# EAGLE design 2019-03-06-can-display-v8.1 (EAGLE 9.4.1)

## Sheet 1 of 2
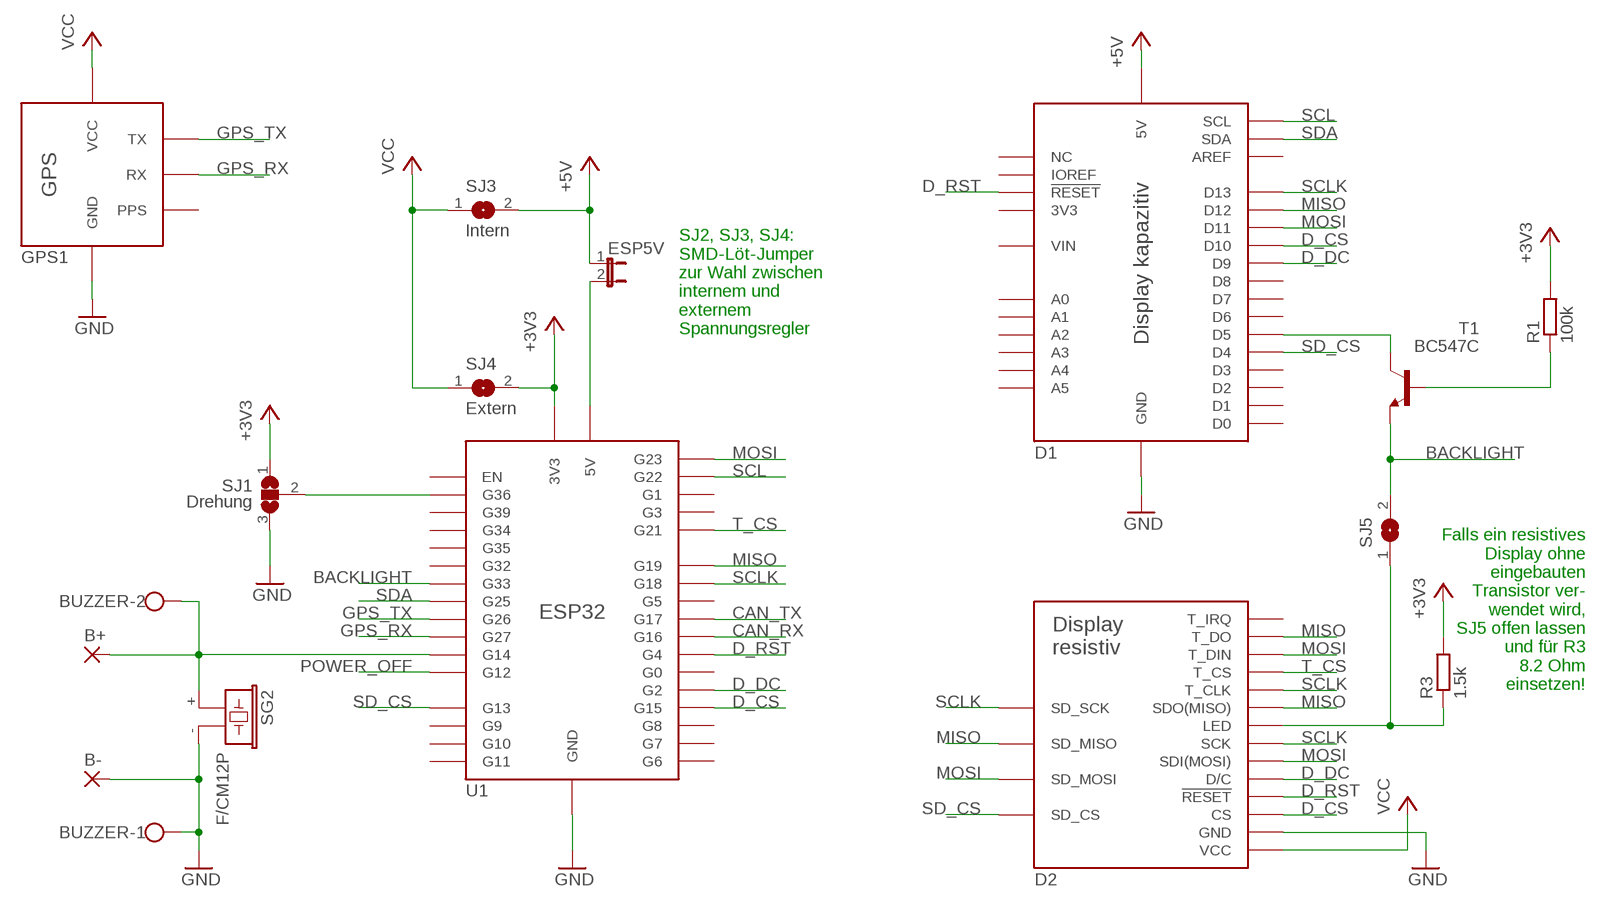
[diagram p0: schematic, sheet 1]

### Parts
B+  WIREPADSMD5-2,5  [5-2,5]
B-  WIREPADSMD5-2,5  [5-2,5]
BUZZER  W237-102  [W237-102]
D1  TFT-KAPAZITIV  [TFT-KAPAZITIV]
D2  TFT-RESISTIV  [TFT-RESISTIV]
ESP5V  ESP 5V  JP1E  [JP1]
GPS1  GPS  [GPS]
R1  100k  R-EU_VMTA55  [VMTA55]
R3  1.5k  R-EU_VMTA55  [VMTA55]
SG2  F/CM12P  [F/CM12P]
SJ1  Drehung  SJ2W  [SJ_2]
SJ3  Intern  SJ  [SJ]
SJ4  Extern  SJ  [SJ]
SJ5  const.  SJ  [SJ]
T1  BC547C  -NPN-TO92  [TO92]
U1  ESP32  [ESP32]

### Nets
+3V3: R1.2 R3.2 SJ1.1 SJ4.2 U1.3V3 U1.3V3S(3V3) ; also sheet 2
+5V: D1.5V ESP5V.1 SJ3.2 ; also sheet 2
BACKLIGHT: SJ5.2 T1.1(E) U1.G33 U1.G33S(G33)
BUZZER: B+.1(P) BUZZER.2 SG2.+ U1.G14 U1.G14S(G14)
CAN_RX: U1.G16 ; also sheet 2
CAN_TX: U1.G17 ; also sheet 2
D_CS: D1.D10 D2.LCD_CS(CS) U1.G15
D_DC: D1.D9 D2.LCD_DC(D/C) U1.G2
D_RST: D1.RESET(!RESET!) D2.LCD_RESET(!RESET!) U1.G4
DIS-BL: D2.LED R3.1 SJ5.1
ESP5V: ESP5V.2 U1.5V U1.5VS(5V)
GND: B-.1(P) BUZZER.1 D1.GND@1(GND) D1.GND@2(GND) D1.GND@3(GND) D2.GND GPS1.GND1(GND) GPS1.GND2(GND) SG2.- SJ1.3 U1.GND@1(GND) U1.GND@2(GND) U1.GND@3(GND) U1.GND@4(GND) ; also sheet 2
GPS_RX: GPS1.RX1(RX) GPS1.RX2(RX) U1.G27 U1.G27S(G27)
GPS_TX: GPS1.TX1(TX) GPS1.TX2(TX) U1.G26 U1.G26S(G26)
MISO: D1.D12 D2.LCD_MISO(SDO(MISO)) D2.SD_MISO D2.T_DO U1.G19
MOSI: D1.D11 D2.LCD_MOSI(SDI(MOSI)) D2.SD_MOSI D2.T_DIN U1.G23
N$1: SJ1.2 U1.G36 U1.G36S(G36)
N$2: D1.D5 T1.3(C)
N$4: R1.1 T1.2(B)
POWER_OFF: U1.G12 U1.G12S(G12) ; also sheet 2
SCL: D1.KAP_SCL(SCL) U1.G22
SCLK: D1.D13 D2.LCD_SCK(SCK) D2.SD_SCK D2.T_CLK U1.G18
SD_CS: D1.D4 D2.SD_CS U1.G13 U1.G13S(G13)
SDA: D1.KAP_SDA(SDA) U1.G25 U1.G25S(G25)
T_CS: D2.T_CS U1.G21
VCC: D2.VCC GPS1.VCC1(VCC) GPS1.VCC2(VCC) SJ3.1 SJ4.1 ; also sheet 2
Unconnected: D1.3V3 D1.A0 D1.A1 D1.A2 D1.A3 D1.A4 D1.A5 D1.AREF D1.D0 D1.D1 D1.D2 D1.D3 D1.D6 D1.D7 D1.D8 D1.IOREF D1.NC@1(NC) D1.VIN D2.T_IRQ GPS1.PPS2(PPS) U1.EN U1.ENS(EN) U1.G0 U1.G1 U1.G3 U1.G5 U1.G6 U1.G7 U1.G8 U1.G9 U1.G9S(G9) U1.G10 U1.G10S(G10) U1.G11 U1.G11S(G11) U1.G32 U1.G32S(G32) U1.G34 U1.G34S(G34) U1.G35 U1.G35S(G35) U1.G39 U1.G39S(G39)

### Notes on the sheet
- SJ2, SJ3, SJ4:
  SMD-Löt-Jumper
  zur Wahl zwischen
  internem und
  externem
  Spannungsregler
- Falls ein resistives
  Display ohne
  eingebauten
  Transistor ver-
  wendet wird,
  SJ5 offen lassen
  und für R3
  8.2 Ohm
  einsetzen!

## Sheet 2 of 2
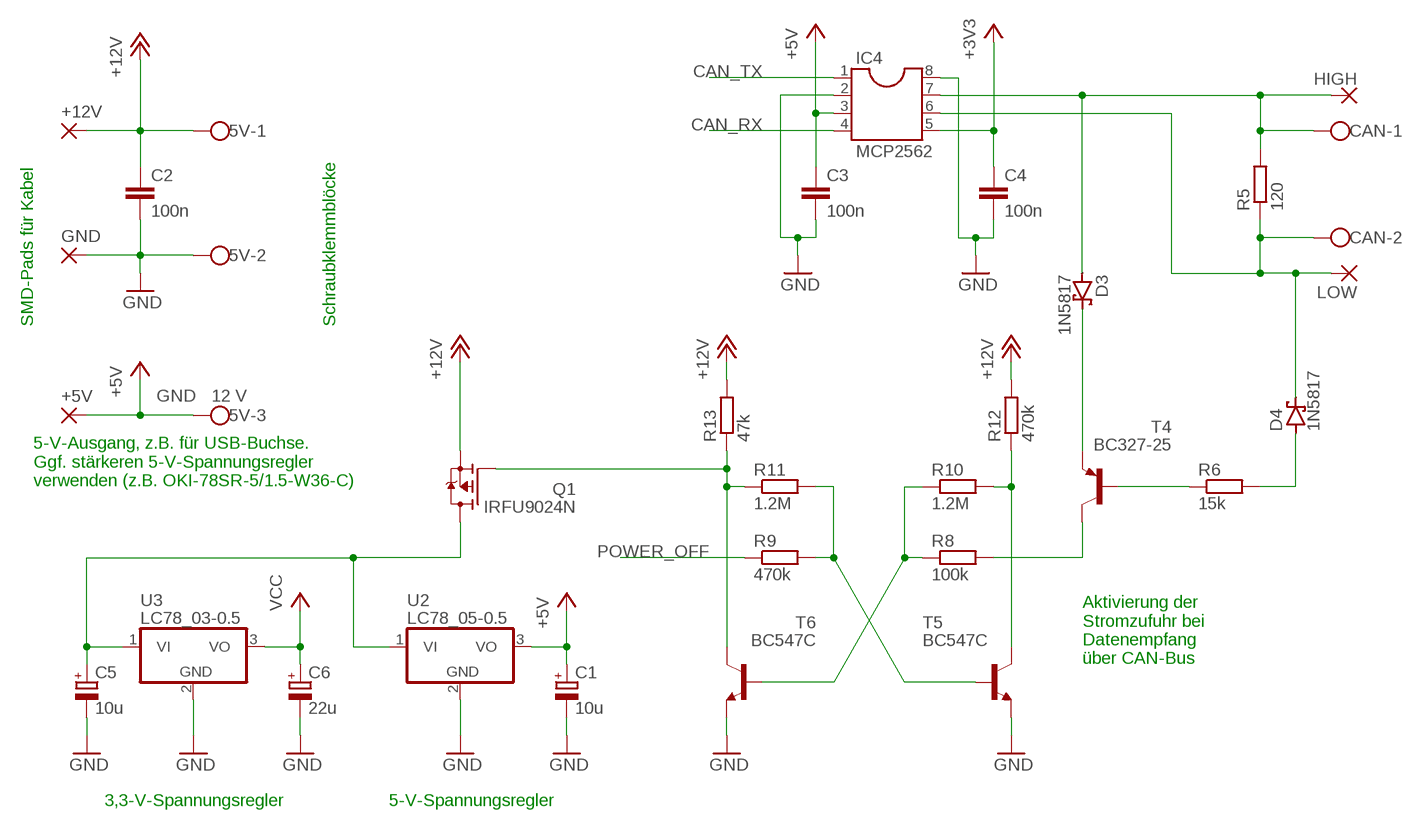
[diagram p1: schematic, sheet 2]

### Parts
5V  GND 12 V  W237-103  [W237-103]
+5V  WIREPADSMD5-2,5  [5-2,5]
+12V  WIREPADSMD5-2,5  [5-2,5]
C1  10u  CPOL-EUE1.8-4  [E1,8-4]
C2  100n  C-EU025-025X050  [C025-025X050]
C3  100n  C-EU025-025X050  [C025-025X050]
C4  100n  C-EU025-025X050  [C025-025X050]
C5  10u  CPOL-EUE1.8-4  [E1,8-4]
C6  22u  CPOL-EUE1.8-4  [E1,8-4]
CAN  W237-102  [W237-102]
D3  1N5817  1N5817-T  [DO41-7.6]
D4  1N5817  1N5817-T  [DO41-7.6]
GND  WIREPADSMD5-2,5  [5-2,5]
HIGH  WIREPADSMD5-2,5  [5-2,5]
IC4  MCP2562  DIL8  [DIL08]
LOW  WIREPADSMD5-2,5  [5-2,5]
Q1  IRFU9024N  P-CHANNEL-MOSFET  [TO251AA-V]
R5  120  R-EU_VMTA55  [VMTA55]
R6  15k  R-EU_VMTA55  [VMTA55]
R8  100k  R-EU_VMTA55  [VMTA55]
R9  470k  R-EU_VMTA55  [VMTA55]
R10  1.2M  R-EU_VMTA55  [VMTA55]
R11  1.2M  R-EU_VMTA55  [VMTA55]
R12  470k  R-EU_VMTA55  [VMTA55]
R13  47k  R-EU_VMTA55  [VMTA55]
T4  BC327-25  -PNP-TO92  [TO92]
T5  BC547C  -NPN-TO92  [TO92]
T6  BC547C  -NPN-TO92  [TO92]
U2  LC78_05-0.5  SPANNUNGSREGLER  [SPANNUNGSREGLER]
U3  LC78_03-0.5  SPANNUNGSREGLER  [SPANNUNGSREGLER]

### Nets
+3V3: C4.1 IC4.5 ; also sheet 1
+5V: 5V.3 +5V.1(P) C1.+ C3.1 IC4.3 U2.3(VO) ; also sheet 1
+12V: 5V.1 +12V.1(P) C2.1 Q1.3(S) R12.2 R13.2
CAN_RX: IC4.4 ; also sheet 1
CAN_TX: IC4.1 ; also sheet 1
GND: 5V.2 C1.- C2.2 C3.2 C4.2 C5.- C6.- GND.1(P) IC4.2 IC4.8 T5.1(E) T6.1(E) U2.2(GND) U3.2(GND) ; also sheet 1
N$8: D3.C T4.1(E)
N$9: R6.1 T4.2(B)
N$10: D4.A R6.2
N$11: R8.1 R10.1 T6.2(B)
N$13: CAN.1 D3.A HIGH.1(P) IC4.7 R5.2
N$14: CAN.2 D4.C IC4.6 LOW.1(P) R5.1
N$15: R8.2 T4.3(C)
N$16: R9.2 R11.2 T5.2(B)
N$17: R10.2 R12.1 T5.3(C)
N$18: Q1.1(G) R11.1 R13.1 T6.3(C)
N$20: C5.+ Q1.2(D) U2.1(VI) U3.1(VI)
POWER_OFF: R9.1 ; also sheet 1
VCC: C6.+ U3.3(VO) ; also sheet 1

### Notes on the sheet
- SMD-Pads für Kabel | Schraubklemmblöcke
- 5-V-Ausgang, z.B. für USB-Buchse.
  Ggf. stärkeren 5-V-Spannungsregler
  verwenden (z.B. OKI-78SR-5/1.5-W36-C)
- Aktivierung der
  Stromzufuhr bei
  Datenempfang
  über CAN-Bus
- 3,3-V-Spannungsregler | 5-V-Spannungsregler

## Library data of the parts
5V = con-wago-500:W237-103: WAGO SCREW CLAMP; MPN: 237-103; OC_FARNELL: unknown; OC_NEWARK: 18M7116
+5V +12V B+ B- GND HIGH LOW = wirepad:WIREPAD: Wire PAD connect wire on PCB
BUZZER CAN = con-wago-500:W237-102: WAGO SCREW CLAMP; MPN: 237-102; OC_FARNELL: unknown; OC_NEWARK: 70K9898
C1 C5 C6 = rcl:CPOL-EU: POLARIZED CAPACITOR, European symbol; SPICEPREFIX: C
C2-C4 = rcl:C-EU: CAPACITOR, European symbol; SPICEPREFIX: C
D1 = CAN-Display:TFT-KAPAZITIV: TFT-Kapazitiv
D2 = CAN-Display:TFT-RESISTIV: TFT-Resistiv
D3 D4 = diode:1N581*: 1.0A SCHOTTKY BARRIER RECTIFIER Source: http://www.diodes.com/datasheets/ds23001.pdf
ESP5V = jumper:JP1E: JUMPER
GPS1 = CAN-Display:GPS: GPS
IC4 = ic-package:DIL8: Dual In Line / Socket
Q1 = CAN-Display:P-CHANNEL-MOSFET
R1 R3 R5 R6 R8-R13 = rcl:R-EU_: RESISTOR, European symbol; SPICEPREFIX: R
SG2 = buzzer:F/CM12P: BUZZER Source: Buerklin; OC_FARNELL: unknown; OC_NEWARK: unknown
SJ1 = jumper:SJ2W: SMD solder JUMPER
SJ3-SJ5 = jumper:SJ: SMD solder JUMPER
T1 T5 T6 = transistor:*-NPN-: NPN Transistror BF959 corrected 2008.03.06
T4 = transistor:*-PNP-: PNP Transistror
U1 = CAN-Display:ESP32: ESP32 Development Board
U2 U3 = CAN-Display:SPANNUNGSREGLER

## Board
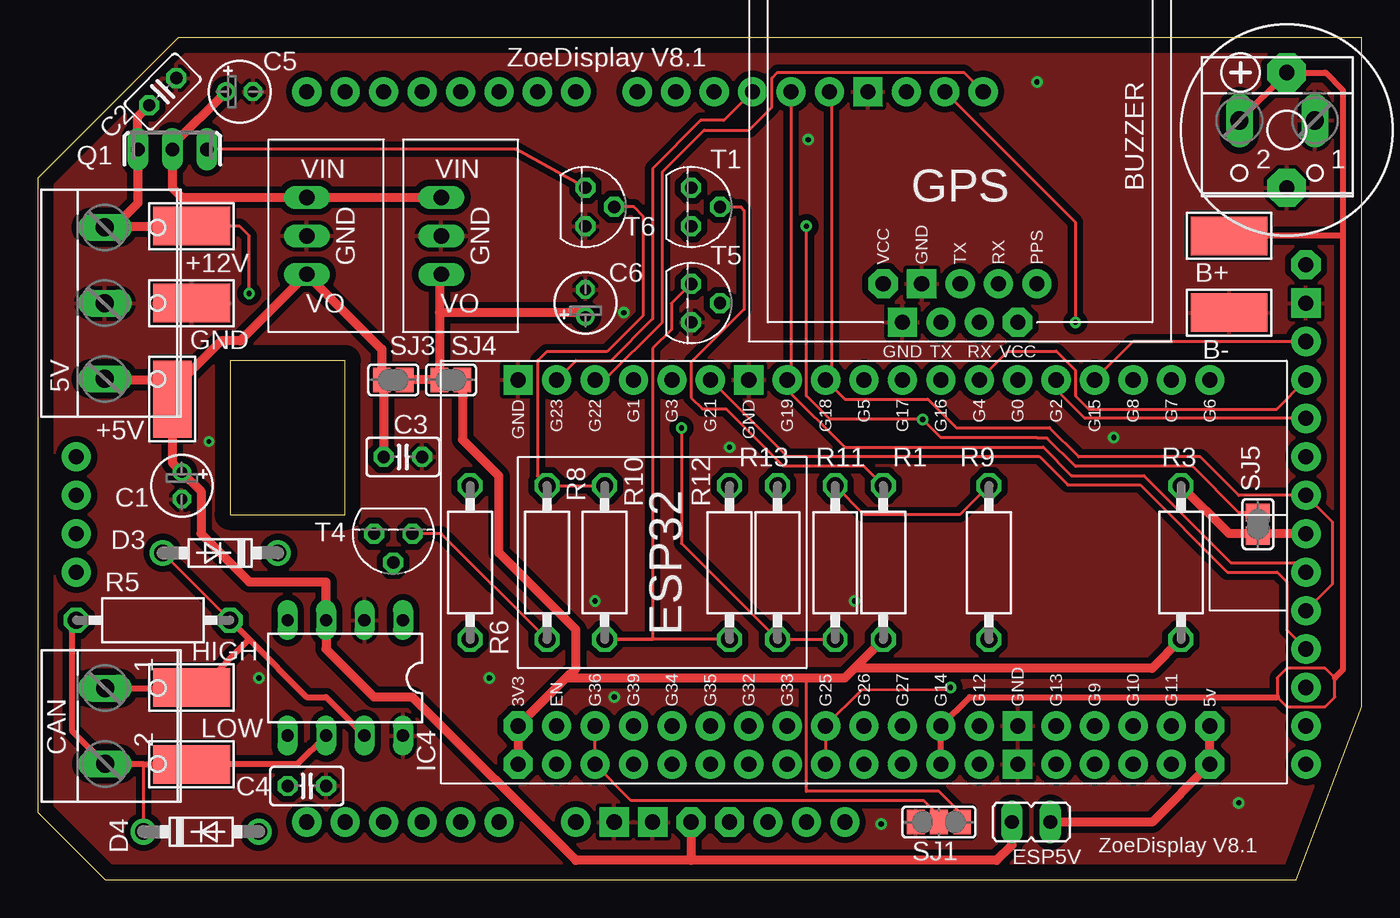
[diagram p2: board, top side]
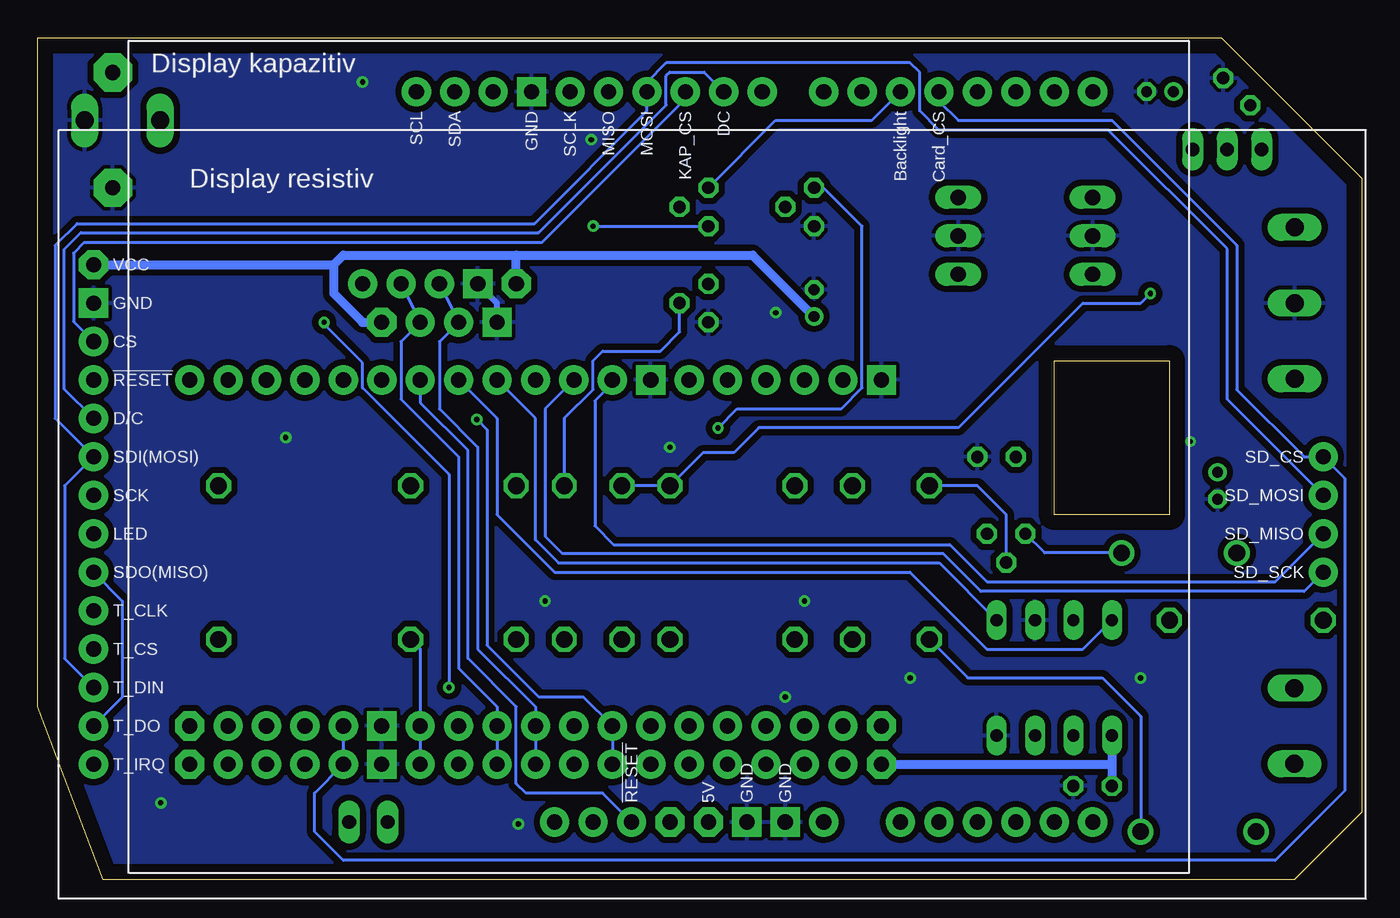
[diagram p3: board, bottom side, seen from below]

Size 87.5 x 55.63 mm. Coordinates in mm from the lower left corner, seen from the top.
Outline: 0,46.35 0,4.45 4.45,0 83.19,0 87.5,11.43 87.5,55.63 9.27,55.63 0,46.35
Outline: 20.32,34.29 12.7,34.29 12.7,24.13 20.32,24.13 20.32,34.29
Copper layers (1*16): Top 0.035mm / dielectric 1.5mm / Bottom 0.035mm
Design rules "default *": minimum track width 6mil, minimum drill 0.35mm, track to track 16mil, track to pad 8mil, pad to pad 10mil, via to via 20mil, smd to smd 6mil, copper to edge 40mil, drill to drill 6mil, minimum pad ring 10mil, minimum via ring 8mil, stop-mask expansion 4mil, vias tented up to drill 0mil, thermal gap 10mil

### Footprints (pad centres in the part's own frame; a part is rotated, then mirrored left to right if it is on the bottom)
W237-103 = drill 1.194 long: 1 -5,-1.29; 2 0,-1.29; 3 5,-1.29
5-2,5 = smd 2.54 x 5.08: 1 0,0
W237-102 = drill 1.194 long: 1 -2.5,-1.27; 2 2.5,-1.27
E1,8-4 = drill 0.711 pad 1.168: + -0.889,0 | drill 0.711 pad 1.168 octagon: - 0.889,0
C025-025X050 = drill 0.813 octagon: 1 -1.27,0; 2 1.27,0
TFT-KAPAZITIV = drill 1 pad 1.93 octagon: 3V3 1.27,-24.13; 5V 3.81,-24.13 | drill 1 pad 1.93: A0 16.51,-24.13; A1 19.05,-24.13; A2 21.59,-24.13; A3 24.13,-24.13; A4 26.67,-24.13; A5 29.21,-24.13; AREF -10.414,24.13; D0 29.21,24.13; D1 26.67,24.13; D2 24.13,24.13; D3 21.59,24.13; D4 19.05,24.13; D5 16.51,24.13; D6 13.97,24.13; D7 11.43,24.13; D8 7.366,24.13; D9 4.826,24.13; D10 2.286,24.13; D11 -0.254,24.13; D12 -2.794,24.13; D13 -5.334,24.13; IOREF -3.81,-24.13; KAP_SCL -15.494,24.13; KAP_SDA -12.954,24.13; NC@1 -6.35,-24.13; RESET -1.27,-24.13; VIN 11.43,-24.13 | drill 1 pad 1.93 square: GND@1 6.35,-24.13; GND@2 8.89,-24.13; GND@3 -7.874,24.13
TFT-RESISTIV = drill 1 pad 1.93 square: GND 0,-13.97 | drill 1 pad 1.93: LCD_CS 0,-11.43; LCD_DC 0,-6.35; LCD_MISO 0,3.81; LCD_MOSI 0,-3.81; LCD_RESET 0,-8.89; LCD_SCK 0,-1.27; LED 0,1.27; SD_CS -81.28,-3.81; SD_MISO -81.28,1.27; SD_MOSI -81.28,-1.27; SD_SCK -81.28,3.81; T_CLK 0,6.35; T_CS 0,8.89; T_DIN 0,11.43; T_DO 0,13.97; T_IRQ 0,16.51 | drill 1 pad 1.93 octagon: VCC 0,-16.51
DO41-7.6 = drill 1.1 pad 1.7: A 3.81,0; C -3.81,0
JP1 = drill 0.914 long: 1 0,-1.27; 2 0,1.27
GPS = drill 1 pad 1.93 square: GND1 3.81,0; GND2 2.54,-2.54 | drill 1 pad 1.93: PPS2 -5.08,-2.54; RX1 -1.27,0; RX2 -2.54,-2.54; TX1 1.27,0; TX2 0,-2.54 | drill 1 pad 1.93 octagon: VCC1 -3.81,0; VCC2 5.08,-2.54
DIL08 = drill 0.813 long: 1 -3.81,-3.81; 2 -1.27,-3.81; 3 1.27,-3.81; 4 3.81,-3.81; 5 3.81,3.81; 6 1.27,3.81; 7 -1.27,3.81; 8 -3.81,3.81
TO251AA-V = drill 0.889 long: 1 -2.286,0; 2 0,0; 3 2.286,0
VMTA55 = drill 1.1 octagon: 1 -5.08,0; 2 5.08,0
F/CM12P = drill 1.016 pad 2.54 octagon: + 3.81,0; - -3.81,0
SJ_2 = smd 1.168 x 1.6: 1 -1.524,0; 2 0,0; 3 1.524,0
SJ = smd 1.168 x 1.6: 1 -0.762,0; 2 0.762,0
TO92 = drill 0.813 octagon: 1 1.27,0; 2 0,1.905; 3 -1.27,0
ESP32 = drill 1 pad 1.93 octagon: 3V3 -12.7,20.32; 3V3S -10.16,20.32; 5V -12.7,-25.4; 5VS -10.16,-25.4 | drill 1 pad 1.93: EN -12.7,17.78; ENS -10.16,17.78; G0 12.7,-12.7; G1 12.7,12.7; G2 12.7,-15.24; G3 12.7,10.16; G4 12.7,-10.16; G5 12.7,-2.54; G6 12.7,-25.4; G7 12.7,-22.86; G8 12.7,-20.32; G9 -12.7,-17.78; G9S -10.16,-17.78; G10 -12.7,-20.32; G10S -10.16,-20.32; G11 -12.7,-22.86; G11S -10.16,-22.86; G12 -12.7,-10.16; G12S -10.16,-10.16; G13 -12.7,-15.24; G13S -10.16,-15.24; G14 -12.7,-7.62; G14S -10.16,-7.62; G15 12.7,-17.78; G16 12.7,-7.62; G17 12.7,-5.08; G18 12.7,0; G19 12.7,2.54; G21 12.7,7.62; G22 12.7,15.24; G23 12.7,17.78; G25 -12.7,0; G25S -10.16,0; G26 -12.7,-2.54; G26S -10.16,-2.54; G27 -12.7,-5.08; G27S -10.16,-5.08; G32 -12.7,5.08; G32S -10.16,5.08; G33 -12.7,2.54; G33S -10.16,2.54; G34 -12.7,10.16; G34S -10.16,10.16; G35 -12.7,7.62; G35S -10.16,7.62; G36 -12.7,15.24; G36S -10.16,15.24; G39 -12.7,12.7; G39S -10.16,12.7 | drill 1 pad 1.93 square: GND@1 -12.7,-12.7; GND@2 12.7,5.08; GND@3 12.7,20.32; GND@4 -10.16,-12.7
SPANNUNGSREGLER = drill 1.016 long: 1 -2.54,-2.54; 2 0,-2.54; 3 2.54,-2.54

### Placement (x,y rotation side)
5V  5.71,38.1 270 top
+5V  8.89,31.75 0 top
+12V  10.16,43.18 270 top
B+  78.74,42.55 90 top
B-  78.74,37.47 90 top
BUZZER  81.92,48.9 180 top
C1  9.53,26.04 270 top
C2  8.26,52.07 45 top
C3  24.13,27.94 0 top
C4  17.78,6.19 0 top
C5  13.34,52.07 0 top
C6  36.2,38.1 90 top
CAN  5.71,10.16 270 top
D1  46.99,27.94 0 bottom
D2  83.82,24.13 180 bottom
D3  12.06,21.59 180 top
D4  10.79,3.17 0 top
ESP5V  65.66,3.81 270 top
GND  10.16,38.1 270 top
GPS1  60.96,36.83 180 top
HIGH  10.16,12.7 270 top
IC4  20.32,13.34 180 top
LOW  10.16,7.62 270 top
Q1  8.89,48.26 180 top
R1  55.88,20.95 270 top
R3  75.56,20.95 270 top
R5  7.62,17.14 0 top
R6  28.57,20.95 270 top
R8  33.66,20.95 270 top
R9  62.87,20.95 90 top
R10  37.47,20.95 270 top
R11  52.7,20.95 90 top
R12  45.72,20.95 90 top
R13  48.9,20.95 90 top
SG2  82.55,49.53 90 top
SJ1  59.56,3.81 180 top
SJ3  23.5,33.02 180 top
SJ4  27.3,33.02 0 top
SJ5  80.64,23.5 90 top
T1  43.18,44.45 270 top
T4  23.5,22.86 180 top
T5  43.18,38.1 270 top
T6  36.2,44.45 270 top
U1  52.07,20.32 90 top
U2  20.32,42.55 270 top
U3  29.21,42.55 270 top

### Tracks (layer width: path | path; a pad name or v marks a point on that pad's centre or on a via)
+3V3
  Top 0.203: SJ1.1 61.09,4.32 59.56,5.84 50.8,5.84 50.8,13.34
  Top 0.61: U1.3V3 U1.3V3S 34.92,13.34 | 34.92,13.34 50.8,13.34 53.34,13.34 53.98,13.97 | 34.92,13.34 35.56,13.97 35.56,16.51 30.48,21.59 30.48,26.67 28.07,29.08 SJ4.2 | R3.2 73.66,13.97 53.98,13.97 | R1.2 53.98,13.97
  Bottom 0.61: IC4.5 16.51,7.62 | U1.3V3 16.51,7.62 | 16.51,7.62 C4.1
+5V
  Top 0.406: 5V.3 4.5,33.02
  Top 0.61: 8.89,32.38 8.89,33.02 4.5,33.02 | 8.89,32.38 +5V.1 8.89,27.56 C1.+ 10.79,25.65 10.79,22.86 13.97,19.68 19.05,19.68 IC4.3 19.05,15.24 22.23,12.06 24.77,12.06 35.56,1.27 43.18,1.27 | 8.89,32.38 12.12,35.61 13.39,35.61 U2.3 22.73,35.05 SJ3.2 22.86,32.89 C3.1 | 43.18,1.27 63.37,1.27 64.39,2.29 ESP5V.1 | D1.5V 43.18,1.27
+12V  (via drill 0.35)
  Top 0.203: v13.97,38.73 13.97,42.55 13.34,43.18 +12V.1
  Top 0.61: 5V.1 4.5,43.18 5.08,43.18 | 5.08,43.18 +12V.1 | 5.08,43.18 6.6,44.7 Q1.3 6.6,50.42 C2.1
  Bottom 0.203: v13.97,38.73 14.61,38.1 18.41,38.1 26.64,29.87 39.85,29.87 41.5,28.22 43.53,28.22 R12.2 R13.2
BACKLIGHT  (via drill 0.35)
  Top 0.203: v50.8,43.18 50.8,31.98 52.36,30.42 v58.48,30.42 59.69,29.21 66.04,29.21 66.06,29.18 66.7,29.18 68.58,27.3 76.33,27.3 79.38,24.26 SJ5.2
  Bottom 0.203: U1.G33 U1.G33S 51.44,12.06 54.38,12.06 57.81,15.49 57.81,29.74 v58.48,30.42 | v50.8,43.18 T1.1
BUZZER
  Top 0.203: 81.92,12.06 82.55,11.43 85.09,11.43 85.72,12.06 85.72,13.34 85.09,13.97 82.55,13.97 81.92,13.34 81.92,12.06
  Top 0.406: U1.G14 U1.G14S 61.59,12.06 81.92,12.06 | 86.28,42.55 B+.1 | BUZZER.2 82.55,53.3 | 82.55,53.3 SG2.+ | 86.28,42.55 86.28,52.15 85.09,53.34 85.05,53.3 82.55,53.3 | 86.28,42.55 86.28,13.89 85.72,13.34
CAN_RX
  Bottom 0.203: IC4.4 18.41,15.24 24.77,15.24 29.84,20.32 53.34,20.32 57.15,24.13 57.15,30.48 U1.G16
CAN_TX
  Bottom 0.203: IC4.1 27.91,20.93 53.09,20.93 54.61,22.45 54.61,30.48 U1.G17
D_CS
  Top 0.203: D2.LCD_CS 72.39,35.56 U1.G15
  Bottom 0.203: D2.LCD_CS 85.14,36.88 85.14,41.41 84.46,42.09 54.2,42.09 44.73,51.56 44.73,52.05 D1.D10
D_DC
  Top 0.203: D2.LCD_DC 69.22,30.48 67.31,32.38 U1.G2
  Bottom 0.203: D2.LCD_DC 85.75,32.41 85.75,41.66 84.66,42.75 54.41,42.75 45.97,51.18 45.97,53.11 45.72,53.37 43.46,53.37 D1.D9
D_RST
  Top 0.203: U1.G4 64.14,34.92 67.31,34.92 68.58,33.66 68.58,31.98 69.47,31.09 81.89,31.09 D2.LCD_RESET
  Bottom 0.203: U1.G4 62.23,31.52 59.08,28.37 59.08,14.63 55.88,11.43 55.88,6.35 55.24,5.71 50.16,5.71 D1.RESET
DIS-BL
  Top 0.61: D2.LED 80.64,22.86 | 80.64,22.86 78.74,22.86 R3.1 | 80.64,22.86 SJ5.1
ESP5V
  Top 0.61: ESP5V.2 73.66,3.81 U1.5V U1.5VS
GND  (via drill 0.3, 0.35)
  Bottom 0.406: GPS1.GND1 57.15,38.1 GPS1.GND2
  other vias: 55.75,3.68 29.84,13.34 36.83,18.41 53.98,18.41 45.72,28.57 71.12,29.21 66.04,52.7 38.73,37.47 38.1,12.06 14.61,13.34 79.38,5.08 11.3,28.96 50.93,48.9
  pour Top: 5.71,58.42 -3.81,48.9 -3.81,2.54 1.91,-3.17 80.64,-3.17 82.55,-3.17 90.17,4.45 92.71,6.99 92.71,47.62 92.71,57.15 90.17,59.69 6.99,59.69
  pour Bottom: 6.35,61.59 -5.71,49.53 -5.71,27.94 -5.71,1.27 0,-4.45 0.64,-5.08 65.41,-5.08 83.82,-5.08 92.08,3.17 95.25,6.35 95.25,56.52 95.25,58.42 91.44,62.23 6.99,62.23
GPS_RX
  Bottom 0.203: GPS1.RX2 GPS1.RX1 63.5,35.56 63.5,31.75 59.69,27.94 59.69,13.97 57.15,11.43 U1.G27S U1.G27
GPS_TX
  Bottom 0.203: GPS1.TX2 GPS1.TX1 60.96,35.56 60.96,31.11 58.42,28.57 58.42,15.24 54.61,11.43 U1.G26S U1.G26
MISO
  Top 0.203: D1.D12 49.78,33.27 U1.G19 49.53,32.38 53.34,28.57 66.45,28.57 68.33,26.7 73.12,26.7 78.86,20.95 83.19,20.95 D2.LCD_MISO
  Bottom 0.203: D2.SD_MISO 5.71,19.68 24.77,19.68 27.23,22.15 49.45,22.15 50.69,23.38 50.69,31.64 49.53,32.79 U1.G19 | D2.LCD_MISO 81.92,18.41 81.92,12.06 D2.T_DO
MOSI
  Top 0.203: D1.D11 45.34,50.16 43.81,50.16 40.64,46.99 40.64,37.06 37.87,34.29 35.56,34.29 U1.G23
  Bottom 0.203: D2.SD_MOSI 8.89,31.75 8.89,41.68 16.74,49.53 27.94,49.53 29.21,50.8 29.21,53.34 29.84,53.98 45.97,53.98 47.24,52.7 D1.D11 47.24,50.8 54.69,43.36 84.91,43.36 86.36,41.91 86.36,30.48 D2.LCD_MOSI 85.72,26.04 85.72,14.61 D2.T_DIN
N$1
  Top 0.203: U1.G36S U1.G36 39.22,5.23 58.56,5.23 59.56,4.23 SJ1.2
N$2
  Bottom 0.203: T1.3 38.73,50.16 32.38,50.16 D1.D5
N$4
  Top 0.203: R1.1 54.56,27.36 49.25,27.36 45.49,31.11 43.92,31.11 43.18,31.86 43.18,34.18 46.69,37.69 46.69,44.22 46.45,44.45 T1.2
N$8
  Bottom 0.203: D3.C 20.95,21.59 T4.1
N$9
  Bottom 0.203: T4.2 23.5,24.13 25.4,26.04 R6.1
N$10
  Bottom 0.203: R6.2 26.04,13.34 17.14,13.34 14.61,10.79 D4.A
N$11
  Top 0.203: T6.2 39.4,44.45 40.03,43.81 40.03,37.31 37.62,34.9 33.63,34.9 33.02,34.29 33.02,26.67 R8.1 R10.1
N$13
  Top 0.203: D3.A R5.2
  Top 0.406: IC4.7 19.05,12.06 17.78,12.06 13.97,15.88 | R5.2 13.97,15.88 | CAN.1 10.12,12.66 HIGH.1 10.79,12.7 13.97,15.88
N$14
  Top 0.203: D4.C 6.99,7.62
  Top 0.406: IC4.6 17.14,7.62 16.51,7.62 LOW.1 6.99,7.62 4.49,7.62 CAN.2 2.25,9.86 2.25,17.01 2.38,17.14 R5.1
N$15
  Top 0.203: R8.2 26.67,22.86 T4.3
N$16
  Top 0.203: R9.2 60.96,24.13 54.61,24.13 R11.2
  Bottom 0.203: R11.2 52.7,30.48 50.8,32.38 50.8,34.29 50.16,34.92 46.35,34.92 45.09,36.2 T5.2
N$17
  Top 0.203: T5.3 41.88,38.08 41.88,36.35 40.64,35.11 40.64,15.88 R10.2 R12.1
N$18  (via drill 0.35)
  Top 0.203: Q1.1 31.62,48.26 T6.3 | v42.55,29.84 42.55,22.23 R13.1 R11.1
  Bottom 0.203: v42.55,29.84 41.27,31.11 34.4,31.11 33.02,32.49 33.02,43.18 35.56,45.72 T6.3
N$20
  Top 0.61: U3.1 U2.1 9.53,45.09 8.89,45.72 Q1.2 8.89,48.51 C5.+
POWER_OFF
  Bottom 0.203: R9.1 62.23,15.24 U1.G12S U1.G12
SCL
  Top 0.203: U1.G22 37.47,33.02 41.27,36.83 41.27,46.76 44.04,49.53 46.99,49.53 48.51,51.05 48.51,52.96 48.9,53.34 61.21,53.34 D1.KAP_SCL
SCLK
  Top 0.203: D1.D13 52.45,51.94 52.45,33.4 U1.G18 53.34,31.75 58.83,31.75 60.71,29.87 66.88,29.87 68.81,27.94 76.83,27.94 79.38,25.4 D2.LCD_SCK 85.57,23.65 85.57,19.53 D2.T_CLK
  Bottom 0.203: D2.SD_SCK 3.81,19.05 25.17,19.05 27.66,21.54 52.84,21.54 53.98,22.68 53.98,31.11 U1.G18
SD_CS
  Bottom 0.203: D1.D4 27.94,51.44 26.67,50.16 16.51,50.16 8.26,41.91 8.26,32.38 3.81,27.94 D2.SD_CS 1.12,26.52 1.12,5.87 5.71,1.27 67.31,1.27 69.22,3.17 69.22,5.71 U1.G13 U1.G13S
SDA  (via drill 0.35)
  Top 0.152: 54.43,12.52 54.46,12.55 60.17,12.55 v60.33,12.7
  Top 0.203: D1.KAP_SDA 68.58,43.43 v68.58,36.83 | U1.G25 U1.G25S 54.43,12.52
  Bottom 0.203: v68.58,36.83 68.58,36.69 66.04,34.15 66.04,32.49 60.33,26.78 v60.33,12.7
T_CS
  Top 0.203: U1.G21 49.51,27.96 66.19,27.96 68.08,26.09 72.87,26.09 78.63,20.32 81.92,20.32 82.55,19.68 82.55,16.51 D2.T_CS
VCC
  Top 0.61: SJ3.1 SJ4.1 26.54,37.47 | 26.54,37.47 26.54,40.01 U3.3 | C6.+ 35.94,37.47 26.54,37.47
  Bottom 0.61: D2.VCC 67.94,40.64 | 67.94,40.64 67.31,41.27 55.88,41.27 | 67.94,40.64 67.94,38.73 66.04,36.83 GPS1.VCC1 | GPS1.VCC2 55.88,41.27 | C6.+ 40.26,41.27 55.88,41.27

### Text on the board
tNames: ZoeDisplay V8.1 | ZoeDisplay V8.1